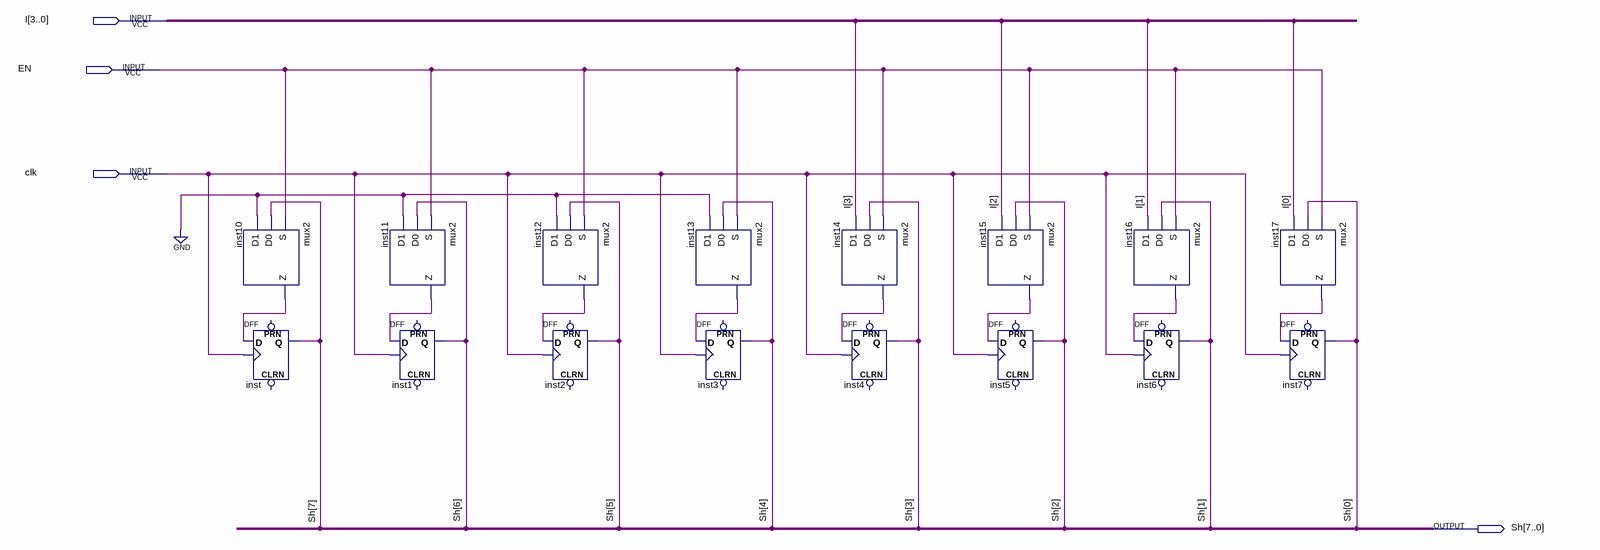
[diagram p0: schematic sheet]
// Quartus schematic load.bdf as structural Verilog: 16 symbols, 4 pins
module load (
  input  [3:0] I,
  input  EN,
  input  clk,
  output [7:0] Sh
);

  wire inst10_z, inst11_z, inst12_z, inst13_z, inst14_z, inst15_z, inst16_z, inst17_z;

  mux2 inst10 (.S(EN), .D0(Sh[7]), .D1(1'b0), .Z(inst10_z));
  DFF inst (.CLK(clk), .D(inst10_z), .Q(Sh[7]));  // open: CLRN, PRN
  mux2 inst11 (.S(EN), .D0(Sh[6]), .D1(1'b0), .Z(inst11_z));
  DFF inst1 (.CLK(clk), .D(inst11_z), .Q(Sh[6]));  // open: CLRN, PRN
  mux2 inst12 (.S(EN), .D0(Sh[5]), .D1(1'b0), .Z(inst12_z));
  DFF inst2 (.CLK(clk), .D(inst12_z), .Q(Sh[5]));  // open: CLRN, PRN
  mux2 inst13 (.S(EN), .D0(Sh[4]), .D1(1'b0), .Z(inst13_z));
  DFF inst3 (.CLK(clk), .D(inst13_z), .Q(Sh[4]));  // open: CLRN, PRN
  mux2 inst14 (.S(EN), .D0(Sh[3]), .D1(I[3]), .Z(inst14_z));
  DFF inst4 (.CLK(clk), .D(inst14_z), .Q(Sh[3]));  // open: CLRN, PRN
  mux2 inst15 (.S(EN), .D0(Sh[2]), .D1(I[2]), .Z(inst15_z));
  DFF inst5 (.CLK(clk), .D(inst15_z), .Q(Sh[2]));  // open: CLRN, PRN
  mux2 inst16 (.S(EN), .D0(Sh[1]), .D1(I[1]), .Z(inst16_z));
  DFF inst6 (.CLK(clk), .D(inst16_z), .Q(Sh[1]));  // open: CLRN, PRN
  mux2 inst17 (.S(EN), .D0(Sh[0]), .D1(I[0]), .Z(inst17_z));
  DFF inst7 (.CLK(clk), .D(inst17_z), .Q(Sh[0]));  // open: CLRN, PRN
endmodule
